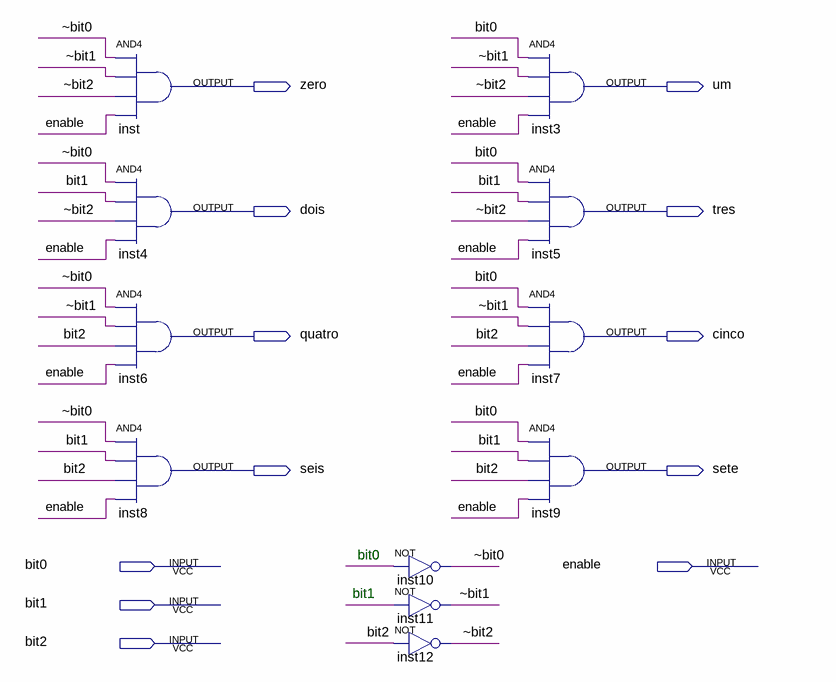
[diagram p0: schematic sheet]
// Quartus schematic decod3x8.bdf as structural Verilog: 11 symbols, 12 pins
module decod3x8 (
  input  bit0,
  input  enable,
  input  bit1,
  input  bit2,
  output zero,
  output um,
  output dois,
  output tres,
  output quatro,
  output cinco,
  output seis,
  output sete
);

  wire \~bit0 , \~bit1 , \~bit2 ;

  and inst (zero, \~bit0 , \~bit1 , \~bit2 , enable);
  and inst4 (dois, \~bit0 , bit1, \~bit2 , enable);
  and inst6 (quatro, \~bit0 , \~bit1 , bit2, enable);
  and inst8 (seis, \~bit0 , bit1, bit2, enable);
  not inst10 (\~bit0 , bit0);
  not inst11 (\~bit1 , bit1);
  not inst12 (\~bit2 , bit2);
  and inst3 (um, bit0, \~bit1 , \~bit2 , enable);
  and inst5 (tres, bit0, bit1, \~bit2 , enable);
  and inst7 (cinco, bit0, \~bit1 , bit2, enable);
  and inst9 (sete, bit0, bit1, bit2, enable);

  // Notes on the sheet:
  //   bit0
  //   bit1
endmodule
